# EAGLE design mixer_board1 (EAGLE 9.4.1)
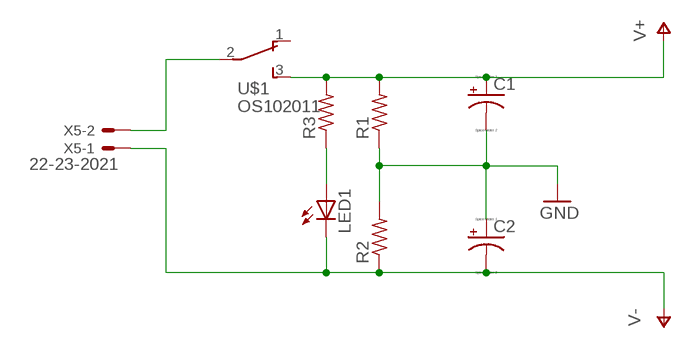
[diagram p0: schematic, sheet 1, part 1 of 2]
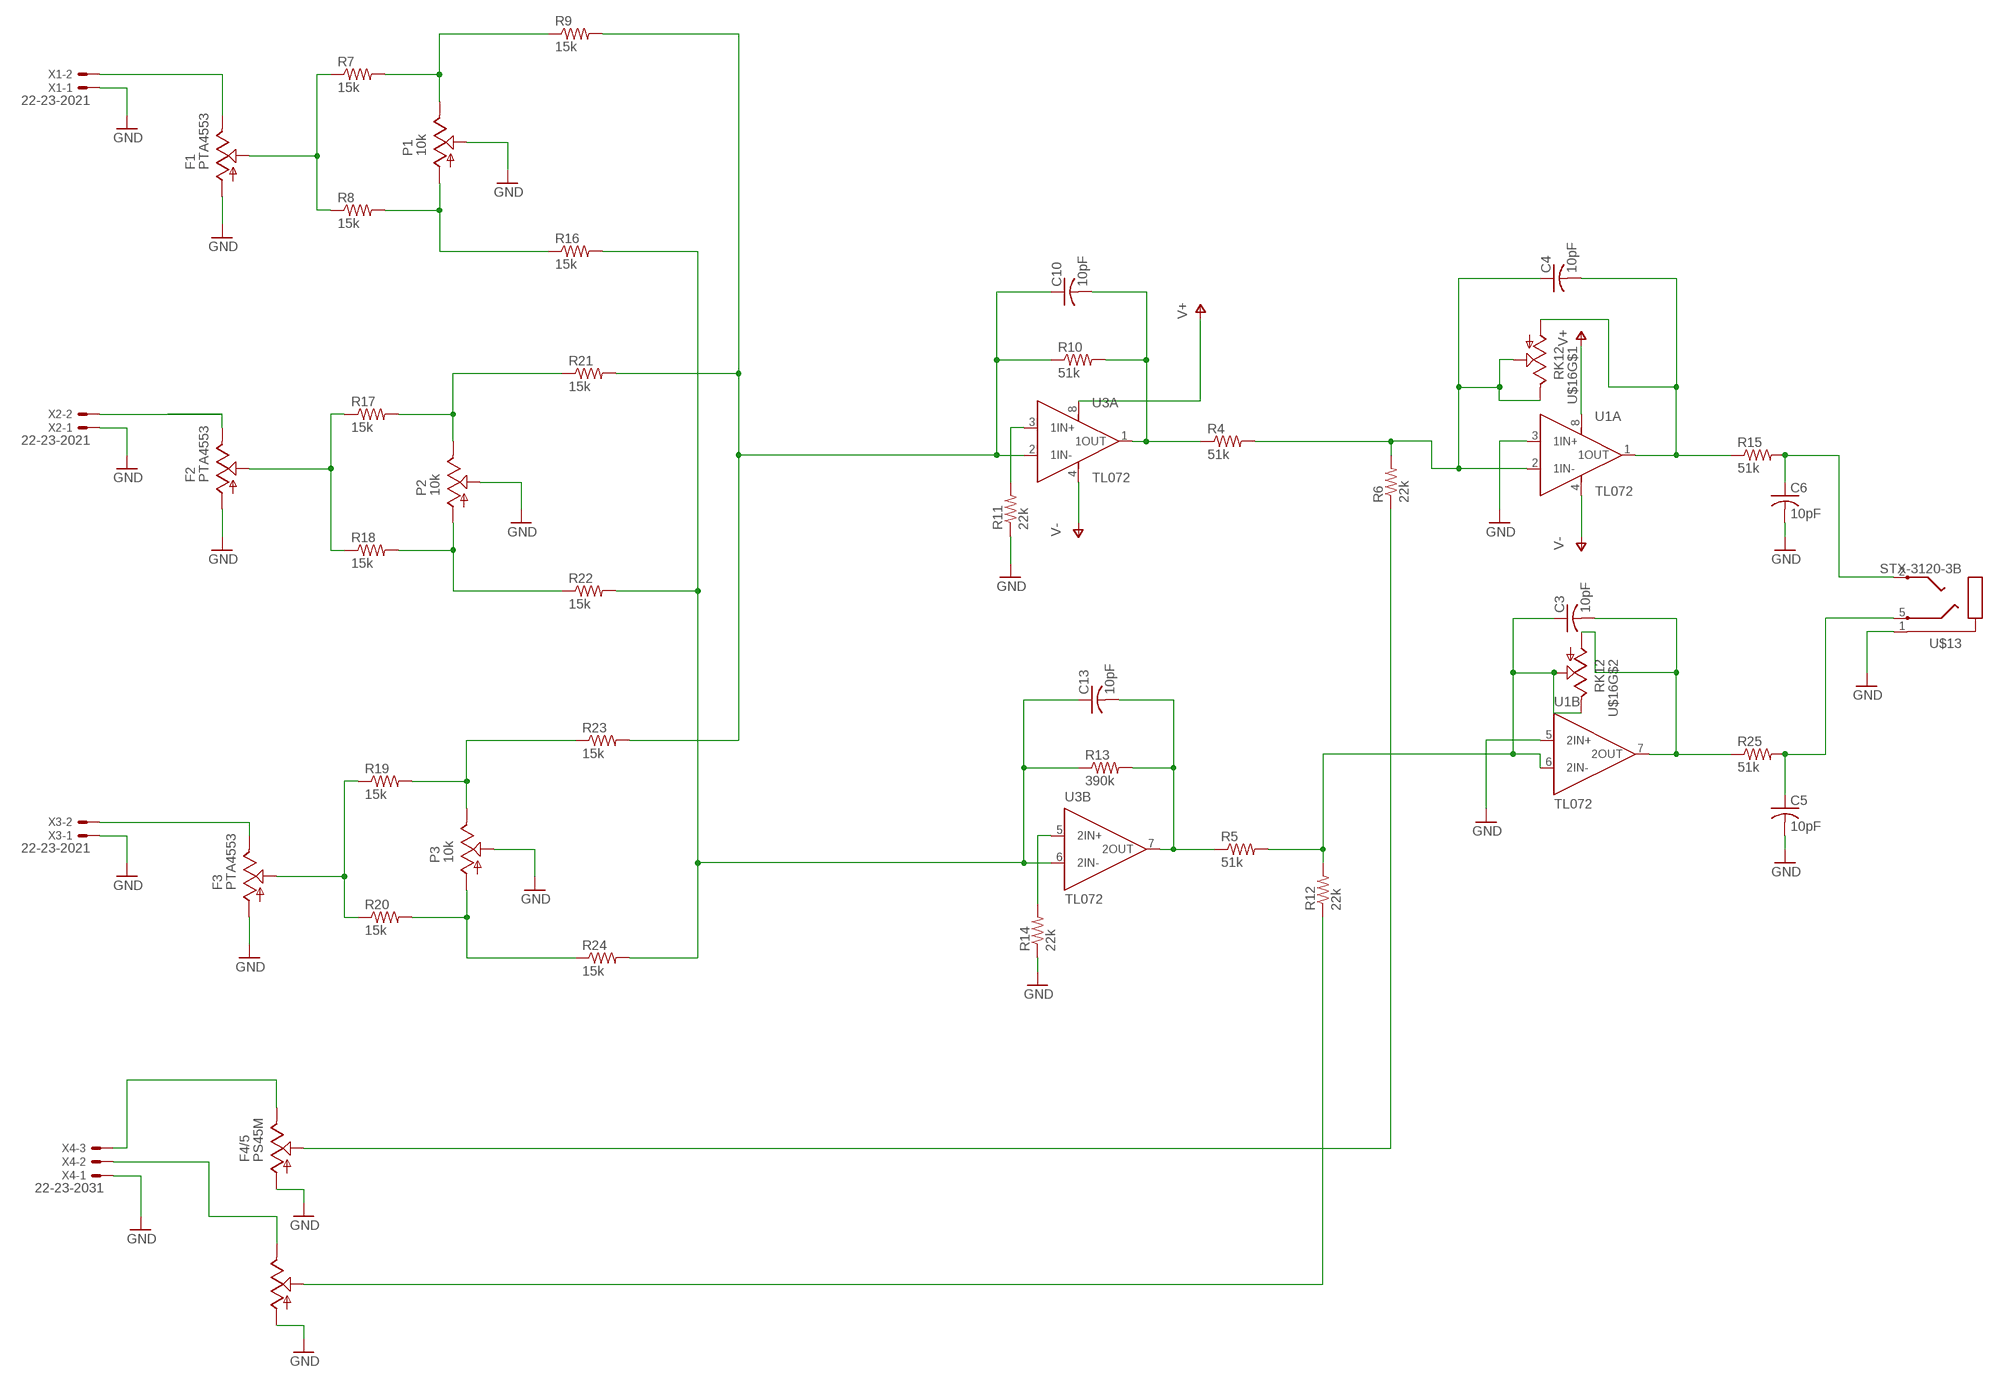
[diagram p1: schematic, sheet 1, part 2 of 2]

## Parts
C1  CPOL-USE1.8-4  [E1,8-4]
C2  CPOL-USE1.8-4  [E1,8-4]
C3  10pF  C-USC0805  [C0805]
C4  10pF  C-USC0805  [C0805]
C5  10pF  C-USC0805  [C0805]
C6  10pF  C-USC0805  [C0805]
C10  10pF  C-USC0805  [C0805]
C13  10pF  C-USC0805  [C0805]
F1  PTA4553  [PTA4553]
F2  PTA4553  [PTA4553]
F3  PTA4553  [PTA4553]
F4/5  PS45M  [PS45M]
LED1  LEDCHIPLED_1206  [CHIPLED_1206]
P1  10k  PTV09A  [PTV09A]
P2  10k  PTV09A  [PTV09A]
P3  10k  PTV09A  [PTV09A]
R1  R-US_M0805  [M0805]
R2  R-US_M0805  [M0805]
R3  R-US_R0805  [R0805]
R4  51k  R-US_M0805  [M0805]
R5  51k  R-US_M0805  [M0805]
R6  22k  R-US_M0805  [M0805]
R7  15k  R-US_M0805  [M0805]
R8  15k  R-US_M0805  [M0805]
R9  15k  R-US_M0805  [M0805]
R10  51k  R-US_M0805  [M0805]
R11  22k  R-US_M0805  [M0805]
R12  22k  R-US_M0805  [M0805]
R13  390k  R-US_M0805  [M0805]
R14  22k  R-US_M0805  [M0805]
R15  51k  R-US_M0805  [M0805]
R16  15k  R-US_M0805  [M0805]
R17  15k  R-US_M0805  [M0805]
R18  15k  R-US_M0805  [M0805]
R19  15k  R-US_M0805  [M0805]
R20  15k  R-US_M0805  [M0805]
R21  15k  R-US_M0805  [M0805]
R22  15k  R-US_M0805  [M0805]
R23  15k  R-US_M0805  [M0805]
R24  15k  R-US_M0805  [M0805]
R25  51k  R-US_M0805  [M0805]
U1  TL072  [DIP794W45P254L1060H508Q8]
U3  TL072  [DIP794W45P254L1060H508Q8]
U$1  OS102011  [OS102011]
U$13  STX-3120-3B  [STX-3120]
U$16  RK12  [RK12]
X1  22-23-2021  [22-23-2021]
X2  22-23-2021  [22-23-2021]
X3  22-23-2021  [22-23-2021]
X4  22-23-2031  [22-23-2031]
X5  22-23-2021  [22-23-2021]

## Nets
GND: C1.- C2.+ C5.2 C6.2 F1.1 F2.1 F3.1 F4/5.1 F4/5.1' P1.2 P2.2 P3.2 R1.1 R2.2 R11.1 R14.1 U1.3(A:1IN+) U1.5(B:2IN+) U$13.1 X1.1 X2.1 X3.1 X4.1
N$1: U$1.2(P) X5.2
N$2: LED1.A R3.1
N$4: X2.2
N$5: F4/5.3 X4.3
N$6: F4/5.3' X4.2
N$7: C4.2 R15.1 U1.1(A:1OUT) U$16.1
N$8: X3.2
N$14: F1.2 R7.1 R8.1
N$15: F4/5.2 R6.1
N$16: P1.3 R7.2 R9.1
N$17: P1.1 R8.2 R16.1
N$18: C10.1 R9.2 R10.1 R21.2 R23.2 U3.2(A:1IN-)
N$19: C10.2 R4.1 R10.2 U3.1(A:1OUT)
N$20: C6.1 R15.2 U$13.2
N$21: C4.1 R4.2 R6.2 U1.2(A:1IN-) U$16.2 U$16.3
N$22: R11.2 U3.3(A:1IN+)
N$23: P2.3 R17.2 R21.1
N$24: C13.2 R5.1 R13.2 U3.7(B:2OUT)
N$25: C5.1 R25.2 U$13.5
N$26: R14.2 U3.5(B:2IN+)
N$27: F4/5.2' R12.1
N$29: C3.2 R25.1 U1.7(B:2OUT) U$16.1'
N$30: C13.1 R13.1 R16.2 R22.2 R24.2 U3.6(B:2IN-)
N$31: P2.1 R18.2 R22.1
N$33: C3.1 R5.2 R12.2 U1.6(B:2IN-) U$16.2' U$16.3'
N$35: P3.3 R19.2 R23.1
N$36: P3.1 R20.2 R24.1
N$37: F1.3 X1.2
N$38: F2.3
N$39: F2.2 R17.1 R18.1
N$42: F3.2 R19.1 R20.1
N$46: F3.3
V+: C1.+ R1.2 R3.2 U1.8(A:VCC+) U3.8(A:VCC+) U$1.3(S)
V-: C2.- LED1.C R2.1 U1.4(A:VCC-) U3.4(A:VCC-) X5.1
Unconnected: U$1.1(O)

## Library data of the parts
C1 C2 = resistor:CPOL-US: POLARIZED CAPACITOR, American symbol
C3-C6 C10 C13 = resistor:C-US: CAPACITOR, American symbol
F1-F3 = biblib:PTA4553
F4/5 = biblib:PS45M
LED1 = led:LED: LED OSRAM: - CHIPLED LG R971, LG N971, LY N971, LG Q971, LY Q971, LO R971, LY R971 LH N974, LH R974 LS Q976, LO Q976, LY Q976 LO Q996 - Hyper CHIPLED LW Q18S LB Q993, LB Q99A, LB R99A - SideLED LS A670, LO A670, LY A670, LG A670, LP A670 LB A673, LV A673, LT A673, LW A673 LH A674 LY A675 LS A676, LA A676, LO A676, LY A676, LW A676 LS A679, LY A679, LG A679 - Hyper Micro SIDELED® LS Y876, LA Y876, LO Y876, LY Y876 LT Y87S - SmartLED LW L88C, LW L88S LB L89C, LB L89S, LG L890 LS L89K, LO L89K, LY L89K LS L896, LA L896, LO L896, LY L896 - TOPLED LS T670, LO T670, LY T670, LG T670, LP T670 LSG T670, LSP T670, LSY T670, LOP T670, LYG T670 LG T671, LOG T671, LSG T671 LB T673, LV T673, LT T673, LW T673 LH T674 LS T676, LA T676, LO T676, LY T676, LB T676, LH T676, LSB T676, LW T676 LB T67C, LV T67C, LT T67C, LS T67K, LO T67K, LY T67K, LW E67C LS E67B, LA E67B, LO E67B, LY E67B, LB E67C, LV E67C, LT E67C LW T67C LS T679, LY T679, LG T679 LS T770, LO T770, LY T770, LG T770, LP T770 LB T773, LV T773, LT T773, LW T773 LH T774 LS E675, LA E675, LY E675, LS T675 LS T776, LA T776, LO T776, LY T776, LB T776 LHGB T686 LT T68C, LB T68C - Hyper Mini TOPLED® LB M676 - Mini TOPLED Santana® LG M470 LS M47K, LO M47K, LY M47K Source: http://www.osram.convergy.de LUXEON: - LUMILED® LXK2-PW12-R00, LXK2-PW12-S00, LXK2-PW14-U00, LXK2-PW14-V00 LXK2-PM12-R00, LXK2-PM12-S00, LXK2-PM14-U00 LXK2-PE12-Q00, LXK2-PE12-R00, LXK2-PE12-S00, LXK2-PE14-T00, LXK2-PE14-U00 LXK2-PB12-K00, LXK2-PB12-L00, LXK2-PB12-M00, LXK2-PB14-N00, LXK2-PB14-P00, LXK2-PB14-Q00 LXK2-PR12-L00, LXK2-PR12-M00, LXK2-PR14-Q00, LXK2-PR14-R00 LXK2-PD12-Q00, LXK2-PD12-R00, LXK2-PD12-S00 LXK2-PH12-R00, LXK2-PH12-S00 LXK2-PL12-P00, LXK2-PL12-Q00, LXK2-PL12-R00 Source: www.luxeon.com KINGBRIGHT: KA-3528ASYC Source: www.kingbright.com
P1-P3 = biblib:PTV09A
R1-R25 = resistor:R-US_: RESISTOR, American symbol
U1 U3 = TL072:TL072: Wide Bandwidth Dual JFET Input Operational Amplifier 8-PDIP 0 to 70; AVAILABILITY: Unavailable; DESCRIPTION: Wide Bandwidth Dual JFET Input Operational Amplifier 8-PDIP 0 to 70; MF: STMicroelectronics; MP: TL072; PACKAGE: SOIC-8 STMicroelectronics; PRICE: None
U$1 = biblib:OS102011
U$13 = biblib:STX-3120-3B
U$16 = biblib:RK12
X1-X3 X5 = con-molex:22-23-2021: .100" (2.54mm) Center Header - 2 Pin; MF: MOLEX; MPN: 22-23-2021; OC_FARNELL: 1462926; OC_NEWARK: 25C3832
X4 = con-molex:22-23-2031: .100" (2.54mm) Center Header - 3 Pin; MF: MOLEX; MPN: 22-23-2031; OC_FARNELL: 1462950; OC_NEWARK: 30C0862

## Board
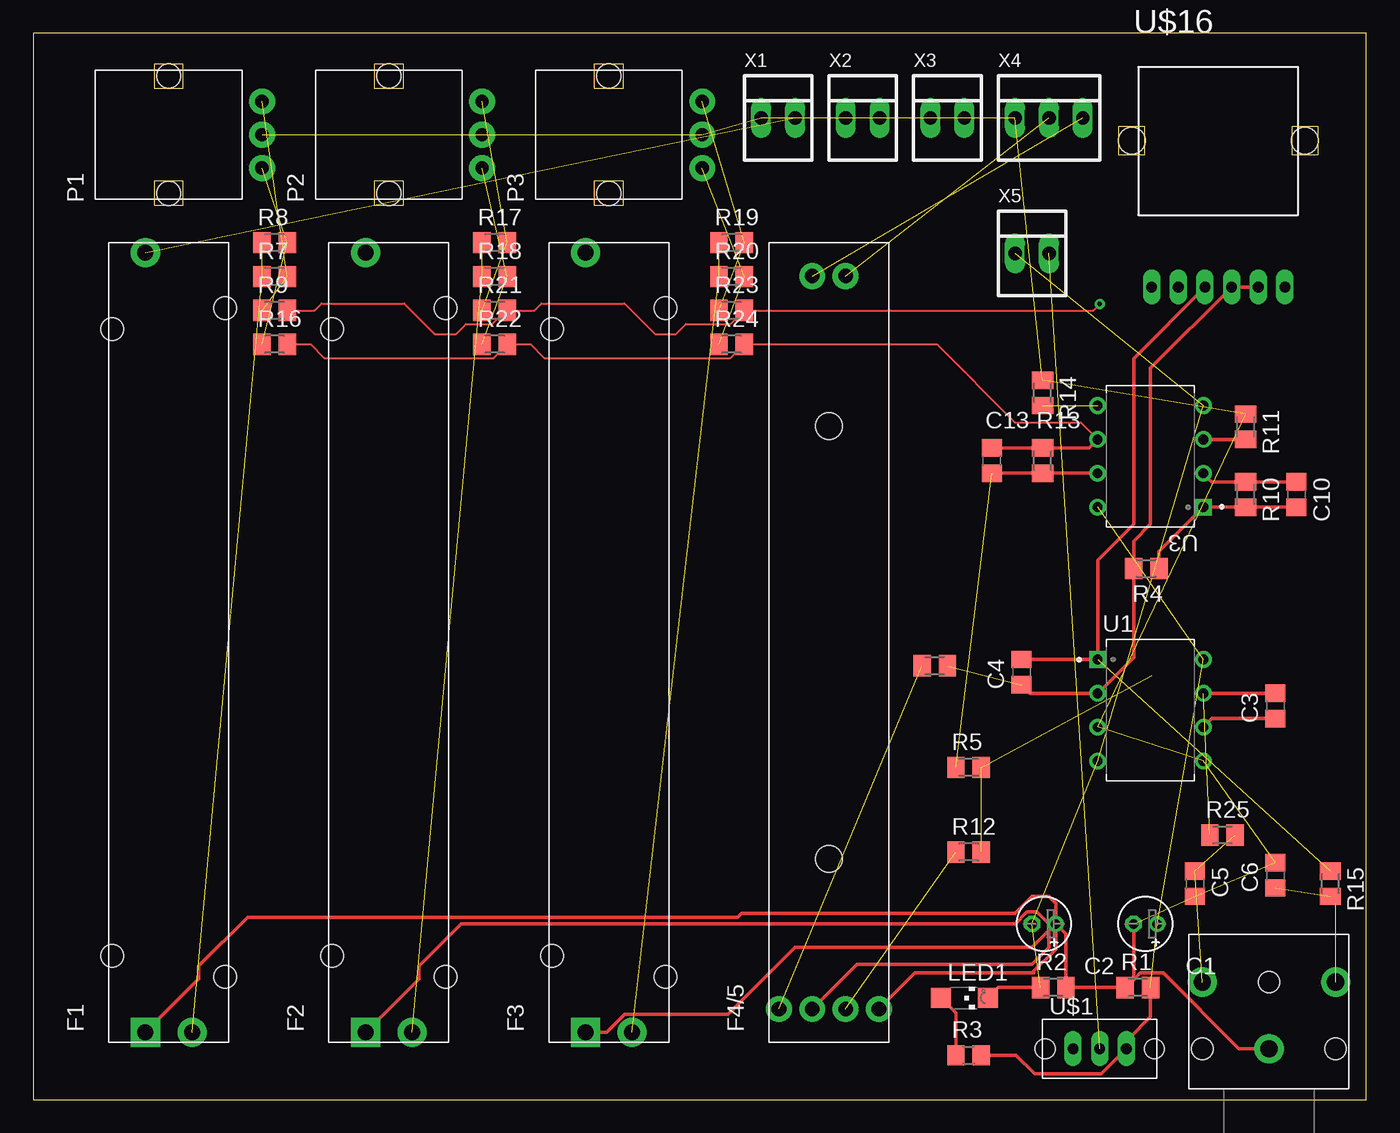
[diagram p2: board, top side]
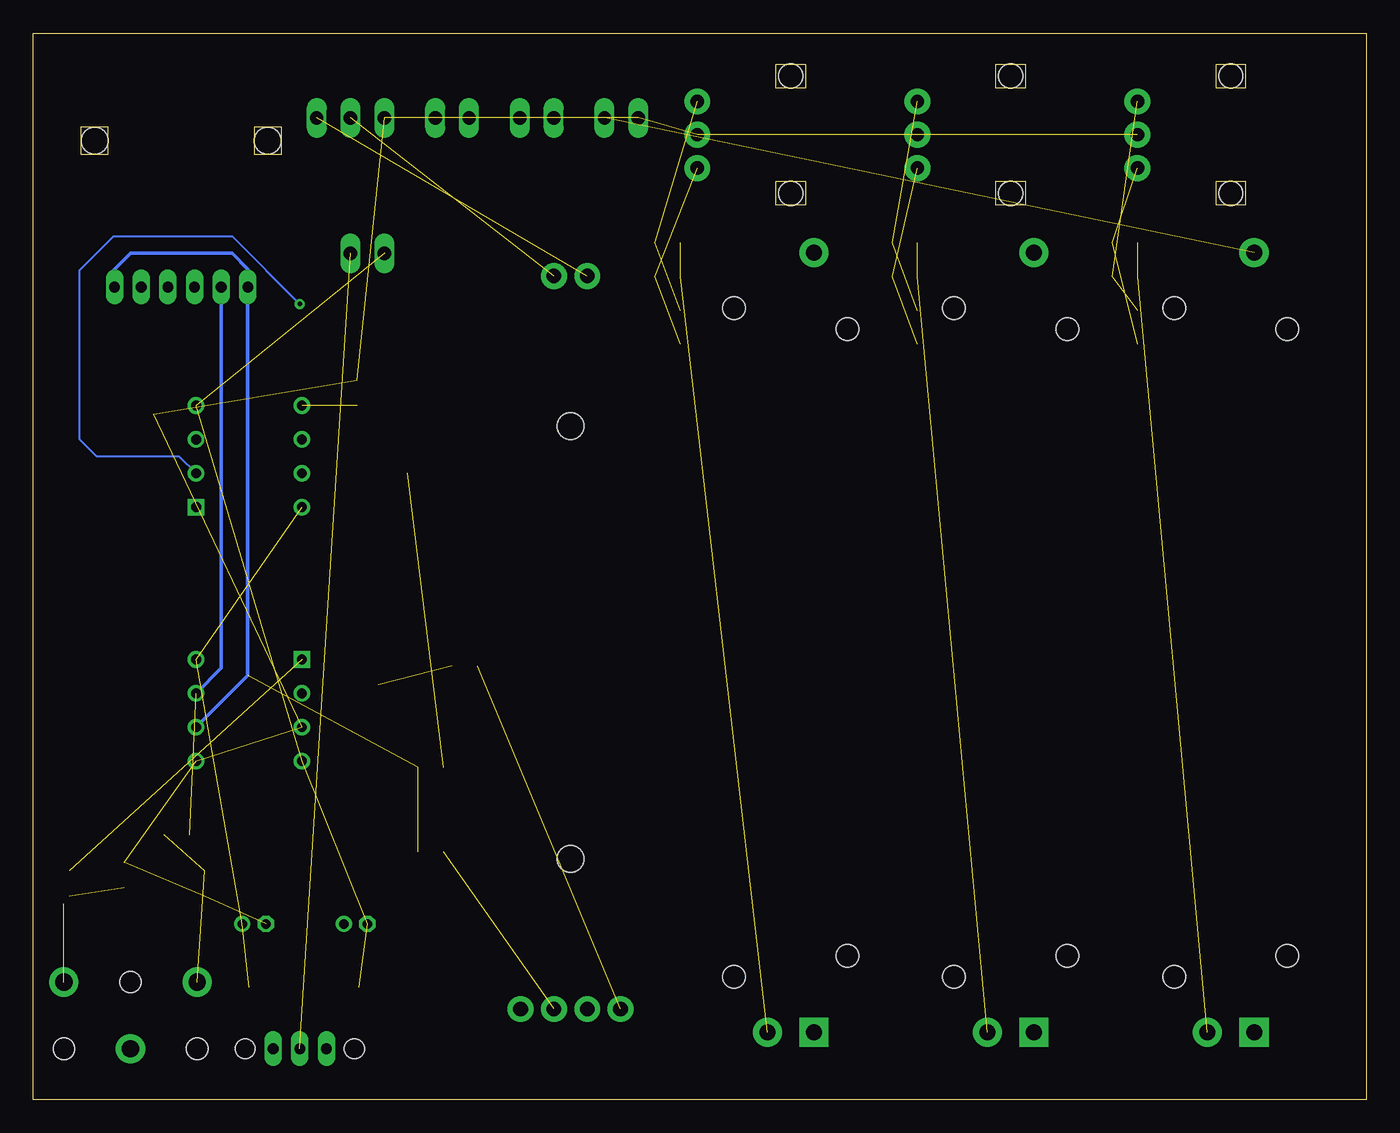
[diagram p3: board, bottom side, seen from below]

Size 100 x 80 mm. Coordinates in mm from the lower left corner, seen from the top.
Outline: 0,0 100,0 100,80 0,80 0,0
Copper layers (1*16): Top 0.035mm / dielectric 1.5mm / Bottom 0.035mm
Design rules "default": minimum track width 6mil, minimum drill 0.35mm, track to track 6mil, track to pad 6mil, pad to pad 6mil, via to via 6mil, smd to smd 6mil, copper to edge 40mil, drill to drill 6mil, minimum pad ring 10mil, minimum via ring 8mil, stop-mask expansion 4mil, vias tented up to drill 0mil, thermal gap 10mil

### Footprints (pad centres in the part's own frame; a part is rotated, then mirrored left to right if it is on the bottom)
E1,8-4 = drill 0.711 pad 1.168: + -0.889,0 | drill 0.711 pad 1.168 octagon: - 0.889,0
C0805 = smd 1.3 x 1.5: 1 -0.95,0; 2 0.95,0
PTA4553 = drill 1.2 pad 2.184 square: 1 -29.25,1.75 | drill 1.2 pad 2.184: 2 -29.25,-1.75; 3 29.25,1.75 | hole 1.7: -23.5,4.25; 23.5,4.25; -25.1,-4.25; 25.1,-4.25
PS45M = drill 1.1 pad 1.93: 1 -27.5,1.25; 1' -27.5,-3.75; 2 -27.5,3.75; 2' -27.5,-1.25; 3 27.5,1.25; 3' 27.5,-1.25 | hole 2: -16.25,0; 16.25,0
CHIPLED_1206 = smd 1.5 x 1.5: A 0,-1.75; C 0,1.75
PTV09A = drill 1 pad 1.93: 1 -2.5,-7; 2 0,-7; 3 2.5,-7 | hole 1.8: -4.4,0; 4.4,0
M0805 = smd 1.3 x 1.6: 1 -0.95,0; 2 0.95,0
R0805 = smd 1.3 x 1.5: 1 -0.95,0; 2 0.95,0
DIP794W45P254L1060H508Q8 = drill 0.74 square: 1 -3.97,3.81 | drill 0.74: 2 -3.97,1.27; 3 -3.97,-1.27; 4 -3.97,-3.81; 5 3.97,-3.81; 6 3.97,-1.27; 7 3.97,1.27; 8 3.97,3.81
OS102011 = drill 0.8 long: 1 -2,0; 2 0,0; 3 2,0 | hole 1.5: -4.1,0; 4.1,0
STX-3120 = drill 1.3 pad 2.184: 1 0,0; 2 5,-5; 5 5,5 | hole 1.6: 0,5; 0,-5; 5,0
RK12 = drill 0.8 long: 1 -1,0; 1' -3,0; 2 1,0; 2' -5,0; 3 3,0; 3' 5,0 | hole 2: -6.5,11; 6.5,11
22-23-2021 = drill 1 long: 1 -1.27,0; 2 1.27,0
22-23-2031 = drill 1 long: 1 -2.54,0; 2 0,0; 3 2.54,0

### Placement (x,y rotation side)
C1  83.44,13.18 180 top
C2  75.82,13.18 180 top
C3  93.19,29.53 90 top
C4  74.14,32.07 90 top
C5  87.15,16.19 270 top
C6  93.19,16.83 90 top
C10  94.77,45.4 270 top
C13  71.91,47.94 270 top
F1  10.16,34.29 90 top
F2  26.67,34.29 90 top
F3  43.18,34.29 90 top
F4/5  59.69,34.29 90 top
LED1  69.85,7.62 270 top
P1  10.16,72.39 90 top
P2  26.67,72.39 90 top
P3  43.18,72.39 90 top
R1  82.87,8.41 0 top
R2  76.52,8.41 0 top
R3  70.17,3.33 0 top
R4  83.5,39.85 180 top
R5  70.17,24.92 0 top
R6  67.63,32.54 0 top
R7  18.1,61.75 0 top
R8  18.1,64.29 0 top
R9  18.1,59.21 0 top
R10  90.96,45.4 270 top
R11  90.96,50.48 270 top
R12  70.17,18.57 0 top
R13  75.72,47.94 270 top
R14  75.72,53.02 270 top
R15  97.31,16.19 270 top
R16  18.1,56.67 0 top
R17  34.61,64.29 0 top
R18  34.61,61.75 0 top
R19  52.39,64.29 0 top
R20  52.39,61.75 0 top
R21  34.61,59.21 0 top
R22  34.61,56.67 0 top
R23  52.39,59.21 0 top
R24  52.39,56.67 0 top
R25  89.22,19.84 0 top
U1  83.82,29.21 0 top
U3  83.82,48.26 180 top
U$1  80.01,3.81 0 top
U$13  92.71,3.81 90 top
U$16  88.9,60.96 0 top
X1  55.88,73.66 0 top
X2  62.23,73.66 0 top
X3  68.58,73.66 0 top
X4  76.2,73.66 0 top
X5  74.93,63.5 0 top

### Tracks (layer width: path | path; a pad name or v marks a point on that pad's centre or on a via)
GND  (13 unrouted)
  Top 0.2: 77.47,8.89 R2.2
  Top 0.254: R2.2 R1.1 81.97,8.41 82.55,8.98 | U$13.1 90.46,3.81 84.78,9.49 83.05,9.49 82.55,8.98 | C1.- 82.55,8.98 | 76.94,8.89 77.47,8.89 77.47,12.42 C2.+ | 74.93,9.49 66.14,9.49 F4/5.1' | 74.93,9.49 75.07,9.49 | F4/5.1 61.81,10.16 74.93,10.16 76.2,11.43 76.2,12.7 | F3.1 42.99,5.04 44.36,6.41 52.13,6.41 57.15,11.43 74.93,11.43 76.2,12.7 | 74.93,9.49 76.71,11.27 C2.+ | C2.+ 76.23,12.7 76.2,12.7 | F2.1 28.93,9.05 28.93,10.02 32.09,13.18 73.67,13.18 74.56,14.07 75.3,14.07 76.19,13.18 C2.+ | F1.1 12.42,9.05 12.42,10.02 16.08,13.68 52.84,13.68 53.12,13.97 73.66,13.97 74.93,15.24 76.2,15.24 76.71,14.73 C2.+
N$1  (1 unrouted)
N$2
  Top 0.254: LED1.A 69.22,6.5 R3.1
N$5  (1 unrouted)
N$6  (1 unrouted)
N$7  (1 unrouted)
  Top 0.254: C4.2 U1.1 79.85,40.48 82.55,43.18 82.55,55.61 U$16.1
N$14  (2 unrouted)
N$15  (1 unrouted)
N$16  (2 unrouted)
N$17  (2 unrouted)
N$18  (via drill 0.35)
  Top 0.152: R9.2 21.09,59.21 21.62,59.73 27.83,59.73 30.12,57.45 31.72,57.45 32.46,58.18 34.41,58.18 35.43,59.21 R21.2 37.6,59.21 38.13,59.73 44.34,59.73 46.63,57.45 48.23,57.45 48.97,58.18 52.31,58.18 R23.2 79.53,59.21 v80.01,59.69
  Top 0.254: U3.2 88.43,46.35 R10.1 C10.1
  Bottom 0.152: U3.2 89.06,48.26 95.25,48.26 96.52,49.53 96.52,62.23 93.98,64.77 85.09,64.77 v80.01,59.69
N$19
  Top 0.254: C10.2 R10.2 U3.1 84.45,41.11 R4.1
N$20  (2 unrouted)
  Top 0.254: 97.71,14.68 R15.2
N$21  (1 unrouted)
  Top 0.254: C4.1 74.78,30.48 U1.2 82.55,33.18 R4.2 82.55,41.91 83.82,43.18 83.82,54.88 U$16.2 U$16.3
N$22
  Top 0.254: U3.3 R11.2
N$23  (2 unrouted)
N$24  (1 unrouted)
  Top 0.254: U3.7 R13.2 C13.2
N$25  (2 unrouted)
N$26  (1 unrouted)
N$27  (1 unrouted)
N$29  (1 unrouted)
  Top 0.254: U1.7 C3.2
  Bottom 0.254: U1.7 85.9,32.37 U$16.1'
N$30
  Top 0.152: R16.2 20.79,56.67 21.82,55.64 34.53,55.64 R22.2 37.3,56.67 38.33,55.64 52.31,55.64 R24.2 67.79,56.67 73.66,50.8 78.58,50.8 U3.6
  Top 0.254: U3.6 79.21,48.89 R13.1 C13.1
N$31  (2 unrouted)
N$33  (2 unrouted)
  Top 0.254: U1.6 88.43,28.58 C3.1
  Bottom 0.254: U1.6 83.9,31.83 U$16.2' 83.9,62.31 85.09,63.5 92.71,63.5 93.98,62.23 93.98,61.04 U$16.3'
N$35  (2 unrouted)
N$36  (2 unrouted)
N$37  (1 unrouted)
N$39  (2 unrouted)
N$42  (2 unrouted)
V+  (3 unrouted)
  Top 0.254: R1.2 83.82,6.2 82.22,4.59 82.22,4.02 U$1.3 80.12,1.92 75.13,1.92 73.71,3.33 R3.2
V-  (4 unrouted)
  Top 0.254: LED1.C 72.39,8.41 R2.1